# EAGLE schematic V1 (EAGLE 9.5.2)
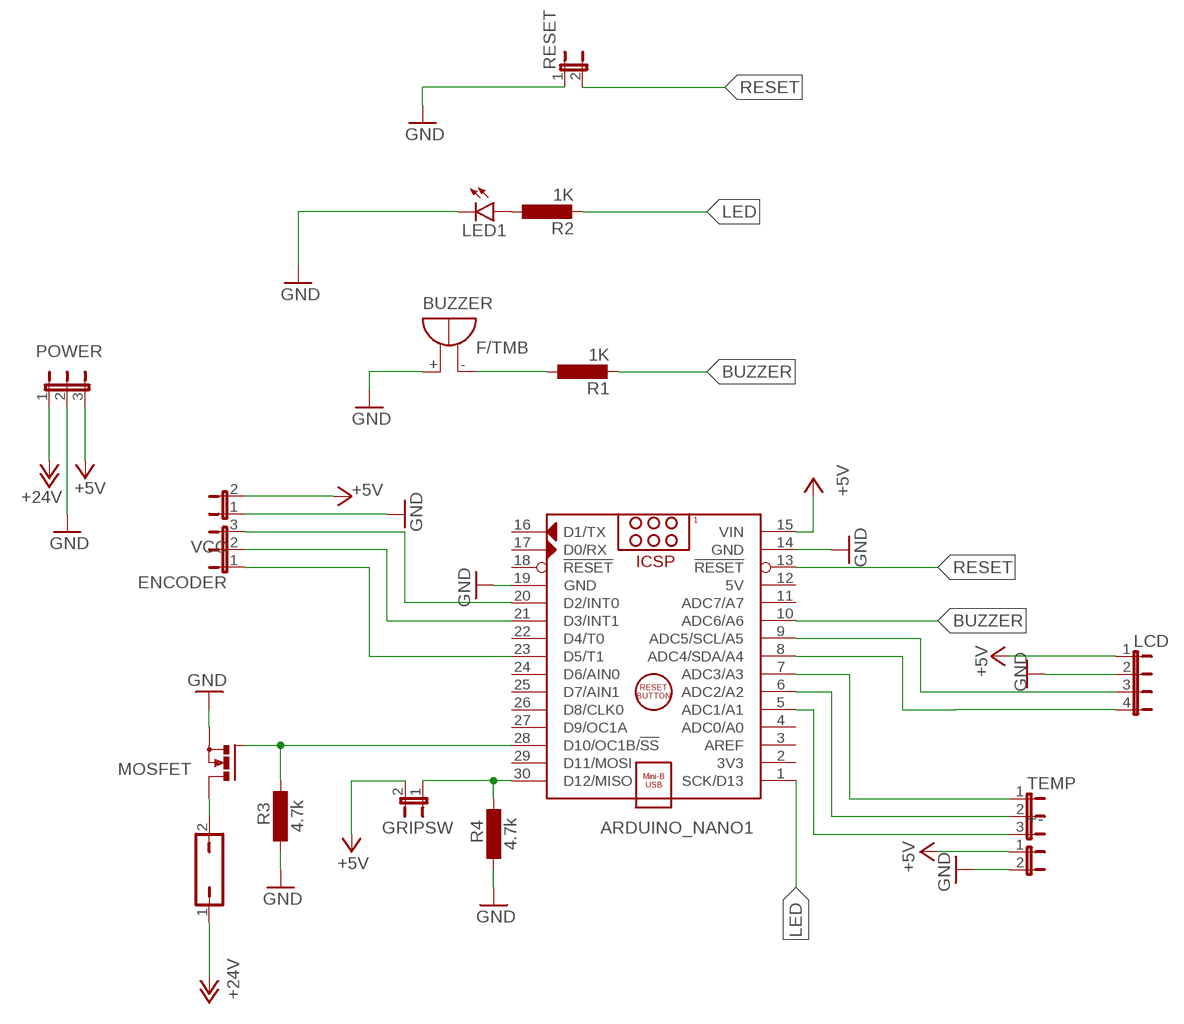
[diagram p0: schematic, sheet 1]

## Parts
+-  JP1E  [JP1]
ARDUINO_NANO1  ARDUINO_NANO  [ARDUINO_NANO]
BUZZER  F/TMB  [F/TMB]
ENCODER  JP2E  [JP2]
GRIPSW  JP1E  [JP1]
HEATER  794681-2  JP1Q  [JP1]
LCD  JP4E  [JP4]
LED1  LED3MM  [LED3MM]
MOSFET  IRLB8721  PMOSFET_NTO220BV  [TO220BV]
POWER  JP2E  [JP2]
R1  1K  L-EU0204/7  [0204/7]
R2  1K  L-EU0204/7  [0204/7]
R3  4.7k  L-EU0204/7  [0204/7]
R4  4.7k  L-EU0204/7  [0204/7]
RESET  JP1E  [JP1]
TEMP  JP2E  [JP2]
VCC  JP1E  [JP1]

## Nets
+5V: +-.1 ARDUINO_NANO1.15(VIN) GRIPSW.2 LCD.1 POWER.3 VCC.2
+24V: HEATER.1 POWER.1
BUZZER: ARDUINO_NANO1.10(ADC6/A6) R1.2
GND: +-.2 ARDUINO_NANO1.14(GND) ARDUINO_NANO1.19(GND) BUZZER.+ LCD.2 LED1.K(C) MOSFET.S POWER.2 R3.2 R4.2 RESET.1 VCC.1
LED [New Class]: ARDUINO_NANO1.1(SCK/D13) R2.2
N$1: ARDUINO_NANO1.28(D10/OC1B/!SS) MOSFET.G R3.1
N$2: ARDUINO_NANO1.21(D3/INT1) ENCODER.2
N$3: BUZZER.- R1.1
N$4: LED1.A R2.1
N$5: ARDUINO_NANO1.30(D12/MISO) GRIPSW.1 R4.1
N$6: ARDUINO_NANO1.20(D2/INT0) ENCODER.3
N$7: ARDUINO_NANO1.5(ADC1/A1) TEMP.3
N$8: ARDUINO_NANO1.6(ADC2/A2) TEMP.2
N$9: HEATER.2 MOSFET.D
N$10: ARDUINO_NANO1.9(ADC5/SCL/A5) LCD.3
N$11: ARDUINO_NANO1.8(ADC4/SDA/A4) LCD.4
N$12: ARDUINO_NANO1.7(ADC3/A3) TEMP.1
N$13: ARDUINO_NANO1.23(D5/T1) ENCODER.1
RESET: ARDUINO_NANO1.13(!RESET) RESET.2
Unconnected: ARDUINO_NANO1.2(3V3) ARDUINO_NANO1.3(AREF) ARDUINO_NANO1.4(ADC0/A0) ARDUINO_NANO1.11(ADC7/A7) ARDUINO_NANO1.16(D1/TX) ARDUINO_NANO1.17(D0/RX) ARDUINO_NANO1.18(!RESET) ARDUINO_NANO1.22(D4/T0) ARDUINO_NANO1.24(D6/AIN0) ARDUINO_NANO1.25(D7/AIN1) ARDUINO_NANO1.26(D8/CLK0) ARDUINO_NANO1.27(D9/OC1A) ARDUINO_NANO1.29(D11/MOSI)

## Power pins joined to a net without a drawn wire
5V: ARDUINO_NANO1.12(5V)

## Library data of the parts
+- GRIPSW RESET VCC = jumper:JP1E: JUMPER
ARDUINO_NANO1 = ArduinoNanoV30:ARDUINO_NANO: Arduino Nano V3.0 Module Overview: The Arduino Nano is a small, complete, and breadboard-friendly board based on the ATmega328 (Arduino Nano 3.x) or ATmega168 (Arduino Nano 2.x). It has more or less the same functionality of the Arduino Duemilanove, but in a different package. It lacks only a DC power jack, and works with a Mini-B USB cable instead of a standard one. The Nano was designed and is being produced by Gravitech <http://www.gravitech.us/arna30wiatp.html>. General specifications: Item Value Microcontroller Atmel ATmega168 or ATmega328 Operating Voltage (logic level) 5 V Input Voltage (recommended) 7-12 V Input Voltage (limits) 6-20 V Digital I/O Pins 14 (of which 6 provide PWM output) Analog Input Pins 8 DC Current per I/O Pin 40 mA Flash Memory 16 KB (ATmega168) or 32 KB (ATmega328) of which 2 KB used by bootloader SRAM 1 KB (ATmega168) or 2 KB (ATmega328) EEPROM 512 bytes (ATmega168) or 1 KB (ATmega328) Clock Speed 16 MHz Dimensions (Inches) 0.73" x 1.70" Dimensions (mm) 18mm x 45mm Overall height About 9 mm (not including pins) Weigth 5 g Power: The Arduino Nano can be powered via the Mini-B USB connection, 6-20V unregulated external power supply (pin 30), or 5V regulated external power supply (pin 27). The power source is automatically selected to the highest voltage source. Memory: The ATmega168 has 16 KB of flash memory for storing code (of which 2 KB is used for the bootloader); the ATmega328 has 32 KB, (also with 2 KB used for the bootloader). The ATmega168 has 1 KB of SRAM and 512 bytes of EEPROM (which can be read and written with the EEPROM library); the ATmega328 has 2 KB of SRAM and 1 KB of EEPROM. Input and Output: Each of the 14 digital pins on the Nano can be used as an input or output, using pinMode(), digitalWrite(), and digitalRead() functions. They operate at 5 volts. Each pin can provide or receive a maximum of 40 mA and has an internal pull-up resistor (disconnected by default) of 20-50 kOhms. In addition, some pins have specialized functions. Visit Arduino - ArduinoBoardNano <https://www.arduino.cc/en/Main/ArduinoBoardNano>
BUZZER = buzzer:F/TMB: BUZZER Source: Buerklin; OC_FARNELL: unknown; OC_NEWARK: unknown
ENCODER POWER TEMP = jumper:JP2E: JUMPER
HEATER = jumper:JP1Q: JUMPER
LCD = jumper:JP4E: JUMPER
LED1 = led:LED: LED OSRAM: - CHIPLED LG R971, LG N971, LY N971, LG Q971, LY Q971, LO R971, LY R971 LH N974, LH R974 LS Q976, LO Q976, LY Q976 LO Q996 - Hyper CHIPLED LW Q18S LB Q993, LB Q99A, LB R99A - SideLED LS A670, LO A670, LY A670, LG A670, LP A670 LB A673, LV A673, LT A673, LW A673 LH A674 LY A675 LS A676, LA A676, LO A676, LY A676, LW A676 LS A679, LY A679, LG A679 - Hyper Micro SIDELED® LS Y876, LA Y876, LO Y876, LY Y876 LT Y87S - SmartLED LW L88C, LW L88S LB L89C, LB L89S, LG L890 LS L89K, LO L89K, LY L89K LS L896, LA L896, LO L896, LY L896 - TOPLED LS T670, LO T670, LY T670, LG T670, LP T670 LSG T670, LSP T670, LSY T670, LOP T670, LYG T670 LG T671, LOG T671, LSG T671 LB T673, LV T673, LT T673, LW T673 LH T674 LS T676, LA T676, LO T676, LY T676, LB T676, LH T676, LSB T676, LW T676 LB T67C, LV T67C, LT T67C, LS T67K, LO T67K, LY T67K, LW E67C LS E67B, LA E67B, LO E67B, LY E67B, LB E67C, LV E67C, LT E67C LW T67C LS T679, LY T679, LG T679 LS T770, LO T770, LY T770, LG T770, LP T770 LB T773, LV T773, LT T773, LW T773 LH T774 LS E675, LA E675, LY E675, LS T675 LS T776, LA T776, LO T776, LY T776, LB T776 LHGB T686 LT T68C, LB T68C - Hyper Mini TOPLED® LB M676 - Mini TOPLED Santana® LG M470 LS M47K, LO M47K, LY M47K Source: http://www.osram.convergy.de LUXEON: - LUMILED® LXK2-PW12-R00, LXK2-PW12-S00, LXK2-PW14-U00, LXK2-PW14-V00 LXK2-PM12-R00, LXK2-PM12-S00, LXK2-PM14-U00 LXK2-PE12-Q00, LXK2-PE12-R00, LXK2-PE12-S00, LXK2-PE14-T00, LXK2-PE14-U00 LXK2-PB12-K00, LXK2-PB12-L00, LXK2-PB12-M00, LXK2-PB14-N00, LXK2-PB14-P00, LXK2-PB14-Q00 LXK2-PR12-L00, LXK2-PR12-M00, LXK2-PR14-Q00, LXK2-PR14-R00 LXK2-PD12-Q00, LXK2-PD12-R00, LXK2-PD12-S00 LXK2-PH12-R00, LXK2-PH12-S00 LXK2-PL12-P00, LXK2-PL12-Q00, LXK2-PL12-R00 Source: www.luxeon.com KINGBRIGHT: KA-3528ASYC Source: www.kingbright.com
MOSFET = transistor-power:PMOSFET_N: Power MOSFET N-Channel
R1-R4 = rcl:L-EU: INDUCTOR, European symbol; SPICEPREFIX: L